# Altium schematic sheet 2_topology.schdoc: Topology
size A3; DrawnBy: André M. P. Mattos; Revision: v0.1; SheetNumber: 2; SheetTotal: 6; DesignedBy: André M. P. Mattos
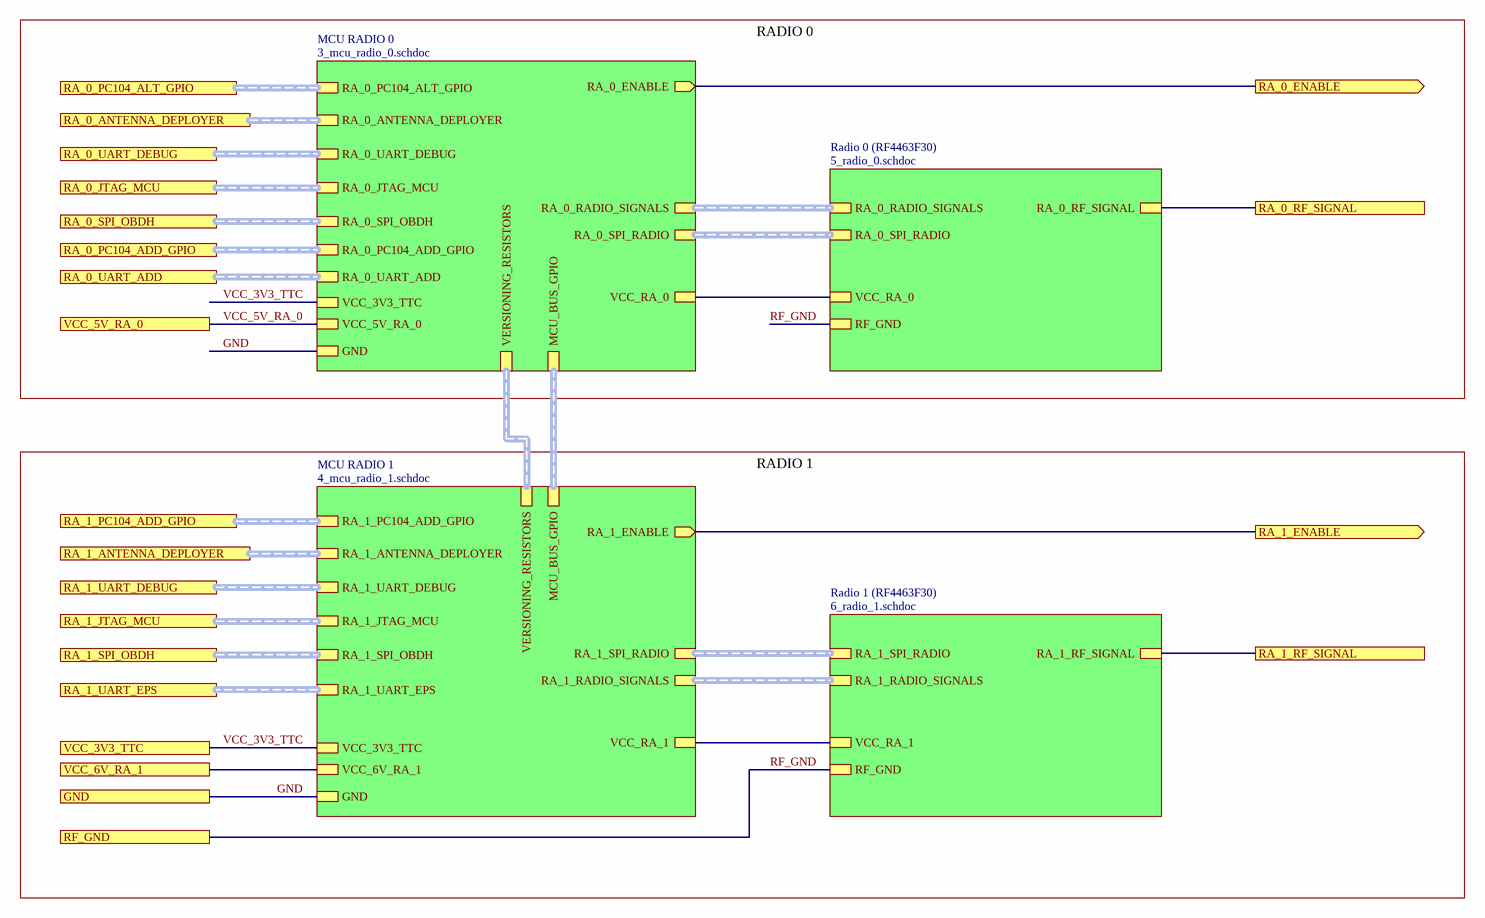
[diagram p0: 2_topology.schdoc]

## Sub-sheets
MCU RADIO 0 = 3_mcu_radio_0.schdoc: VCC_3V3_TTC, GND, RA_0_ENABLE (out), VCC_RA_0, VCC_5V_RA_0, RA_0_ANTENNA_DEPLOYER (harness RA_0_ANTENNA_DEPLOYER), RA_0_JTAG_MCU (harness RA_0_JTAG_MCU), RA_0_UART_DEBUG (harness RA_0_UART_DEBUG), RA_0_RADIO_SIGNALS (harness RA_0_RADIO_SIGNALS), RA_0_SPI_RADIO (harness RA_0_SPI_RADIO), VERSIONING_RESISTORS (harness VERSIONING_RESISTORS), MCU_BUS_GPIO (harness MCU_BUS_GPIO), RA_0_UART_ADD (harness RA_0_UART_ADD), RA_0_SPI_OBDH (harness RA_0_SPI_OBDH), RA_0_PC104_ALT_GPIO (harness RA_0_PC104_ALT_GPIO), RA_0_PC104_ADD_GPIO (harness RA_0_PC104_ADD_GPIO)
MCU RADIO 1 = 4_mcu_radio_1.schdoc: VCC_3V3_TTC, GND, RA_1_ENABLE (out), VCC_RA_1, VCC_6V_RA_1, RA_1_UART_EPS (harness RA_1_UART_EPS), RA_1_PC104_ADD_GPIO (harness RA_1_PC104_ADD_GPIO), RA_1_RADIO_SIGNALS (harness RA_1_RADIO_SIGNALS), RA_1_SPI_RADIO (harness RA_1_SPI_RADIO), RA_1_SPI_OBDH (harness RA_1_SPI_OBDH), VERSIONING_RESISTORS (harness VERSIONING_RESISTORS), RA_1_UART_DEBUG (harness RA_1_UART_DEBUG), RA_1_JTAG_MCU (harness RA_1_JTAG_MCU), RA_1_ANTENNA_DEPLOYER (harness RA_1_ANTENNA_DEPLOYER), MCU_BUS_GPIO (harness MCU_BUS_GPIO)
Radio 0 (RF4463F30) = 5_radio_0.schdoc: RF_GND, RA_0_RF_SIGNAL, VCC_RA_0, RA_0_RADIO_SIGNALS (harness RA_0_RADIO_SIGNALS), RA_0_SPI_RADIO (harness RA_0_SPI_RADIO)
Radio 1 (RF4463F30) = 6_radio_1.schdoc: RF_GND, RA_1_RF_SIGNAL, VCC_RA_1, RA_1_RADIO_SIGNALS (harness RA_1_RADIO_SIGNALS), RA_1_SPI_RADIO (harness RA_1_SPI_RADIO)

## Ports
GND, RA_0_ANTENNA_DEPLOYER (harness RA_0_ANTENNA_DEPLOYER), RA_0_ENABLE (out), RA_0_JTAG_MCU (harness RA_0_JTAG_MCU), RA_0_PC104_ADD_GPIO (harness RA_0_PC104_ADD_GPIO), RA_0_PC104_ALT_GPIO (harness RA_0_PC104_ALT_GPIO), RA_0_RF_SIGNAL, RA_0_SPI_OBDH (harness RA_0_SPI_OBDH), RA_0_UART_ADD (harness RA_0_UART_DEBUG), RA_0_UART_DEBUG (harness RA_0_UART_DEBUG), RA_1_ANTENNA_DEPLOYER (harness RA_1_ANTENNA_DEPLOYER), RA_1_ENABLE (out), RA_1_JTAG_MCU (harness RA_1_JTAG_MCU), RA_1_PC104_ADD_GPIO (harness RA_1_PC104_ADD_GPIO), RA_1_RF_SIGNAL, RA_1_SPI_OBDH (harness RA_1_SPI_OBDH), RA_1_UART_DEBUG (harness RA_1_UART_DEBUG), RA_1_UART_EPS (harness RA_1_UART_EPS), RF_GND, VCC_3V3_TTC, VCC_5V_RA_0, VCC_6V_RA_1

## Nets
GND: port GND, sheet MCU RADIO 0/GND, sheet MCU RADIO 1/GND
RA_0_ENABLE: port RA_0_ENABLE, sheet MCU RADIO 0/RA_0_ENABLE
RA_0_RF_SIGNAL: port RA_0_RF_SIGNAL, sheet Radio 0 (RF4463F30)/RA_0_RF_SIGNAL
RA_1_ENABLE: port RA_1_ENABLE, sheet MCU RADIO 1/RA_1_ENABLE
RA_1_RF_SIGNAL: port RA_1_RF_SIGNAL, sheet Radio 1 (RF4463F30)/RA_1_RF_SIGNAL
RF_GND: port RF_GND, sheet Radio 0 (RF4463F30)/RF_GND, sheet Radio 1 (RF4463F30)/RF_GND
VCC_3V3_TTC: port VCC_3V3_TTC, sheet MCU RADIO 0/VCC_3V3_TTC, sheet MCU RADIO 1/VCC_3V3_TTC
VCC_5V_RA_0: port VCC_5V_RA_0, sheet MCU RADIO 0/VCC_5V_RA_0
VCC_6V_RA_1: port VCC_6V_RA_1, sheet MCU RADIO 1/VCC_6V_RA_1
(unnamed): sheet MCU RADIO 0/VCC_RA_0, sheet Radio 0 (RF4463F30)/VCC_RA_0
(unnamed): sheet MCU RADIO 1/VCC_RA_1, sheet Radio 1 (RF4463F30)/VCC_RA_1

## Buses and harness runs
harness port RA_0_ANTENNA_DEPLOYER = sheet MCU RADIO 0/RA_0_ANTENNA_DEPLOYER
harness port RA_0_JTAG_MCU = sheet MCU RADIO 0/RA_0_JTAG_MCU
harness port RA_0_PC104_ADD_GPIO = sheet MCU RADIO 0/RA_0_PC104_ADD_GPIO
harness port RA_0_PC104_ALT_GPIO = sheet MCU RADIO 0/RA_0_PC104_ALT_GPIO
harness port RA_0_SPI_OBDH = sheet MCU RADIO 0/RA_0_SPI_OBDH
harness port RA_0_UART_ADD = sheet MCU RADIO 0/RA_0_UART_ADD
harness port RA_0_UART_DEBUG = sheet MCU RADIO 0/RA_0_UART_DEBUG
harness port RA_1_ANTENNA_DEPLOYER = sheet MCU RADIO 1/RA_1_ANTENNA_DEPLOYER
harness port RA_1_JTAG_MCU = sheet MCU RADIO 1/RA_1_JTAG_MCU
harness port RA_1_PC104_ADD_GPIO = sheet MCU RADIO 1/RA_1_PC104_ADD_GPIO
harness port RA_1_SPI_OBDH = sheet MCU RADIO 1/RA_1_SPI_OBDH
harness port RA_1_UART_DEBUG = sheet MCU RADIO 1/RA_1_UART_DEBUG
harness port RA_1_UART_EPS = sheet MCU RADIO 1/RA_1_UART_EPS
harness sheet MCU RADIO 0/MCU_BUS_GPIO = sheet MCU RADIO 1/MCU_BUS_GPIO
harness sheet MCU RADIO 0/RA_0_RADIO_SIGNALS = sheet Radio 0 (RF4463F30)/RA_0_RADIO_SIGNALS
harness sheet MCU RADIO 0/RA_0_SPI_RADIO = sheet Radio 0 (RF4463F30)/RA_0_SPI_RADIO
harness sheet MCU RADIO 0/VERSIONING_RESISTORS = sheet MCU RADIO 1/VERSIONING_RESISTORS
harness sheet MCU RADIO 1/RA_1_RADIO_SIGNALS = sheet Radio 1 (RF4463F30)/RA_1_RADIO_SIGNALS
harness sheet MCU RADIO 1/RA_1_SPI_RADIO = sheet Radio 1 (RF4463F30)/RA_1_SPI_RADIO

## Notes on the sheet
- RADIO 0
- RADIO 1
- Project:
- SpaceLab - Federal University of Santa Catarina
- Title:
- Engineer:
- Project Code:
- Date:
- Revision:
- Sheet
- of
- Size:
- A3